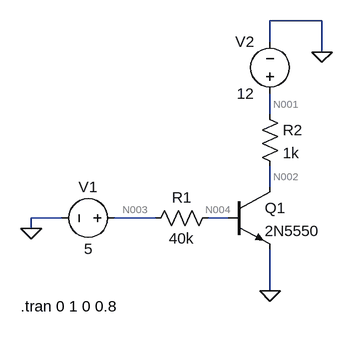
[diagram p0: schematic EJ5.asc]
EJ5.asc, the LTspice schematic file:
Version 4
SHEET 1 880 680
WIRE 432 -288 352 -288
WIRE 352 -256 352 -288
WIRE 432 -240 432 -288
WIRE 352 -144 352 -176
WIRE 352 -32 352 -64
WIRE 32 16 -16 16
WIRE 176 16 112 16
WIRE 288 16 256 16
WIRE -16 32 -16 16
WIRE 352 128 352 64
FLAG 352 128 0
FLAG -16 32 0
FLAG 432 -240 0
SYMBOL npn 288 -32 R0
SYMATTR InstName Q1
SYMATTR Value 2N5550
SYMBOL res 336 -160 R0
SYMATTR InstName R2
SYMATTR Value 1k
SYMBOL res 160 32 R270
WINDOW 0 32 56 VTop 2
WINDOW 3 0 56 VBottom 2
SYMATTR InstName R1
SYMATTR Value 40k
SYMBOL voltage 128 16 R90
WINDOW 0 -32 56 VBottom 2
WINDOW 3 32 56 VTop 2
WINDOW 123 0 0 Left 0
WINDOW 39 0 0 Left 0
SYMATTR InstName V1
SYMATTR Value 5
SYMBOL voltage 352 -160 R180
WINDOW 0 24 96 Left 2
WINDOW 3 24 16 Left 2
WINDOW 123 0 0 Left 0
WINDOW 39 0 0 Left 0
SYMATTR InstName V2
SYMATTR Value 12
TEXT -32 152 Left 2 !.tran 0 1 0 0.8

The netlist it stands for:
* EJ5.asc
Q1 N002 N004 0 0 2N5550
R2 N001 N002 1k
R1 N003 N004 40k
V1 N003 0 5
V2 N001 0 12
.model NPN NPN
.model PNP PNP
.lib standard.bjt
.tran 0 1 0 0.8
.backanno
.end

* Results of the author's LTspice run, read from the files saved beside the schematic
* Operating Point, zero values left out:
*   V(n002) = 178.5 mV
*   V(n004) = 756.9 mV
*   V(n001) = 12 V
*   V(n003) = 5 V
*   Ic(Q1) = 11.82 mA
*   Ib(Q1) = 106.1 µA
*   Ie(Q1) = -11.93 mA
*   I(R2) = 11.82 mA
*   I(R1) = 106.1 µA
*   I(V1) = -106.1 µA
*   I(V2) = -11.82 mA
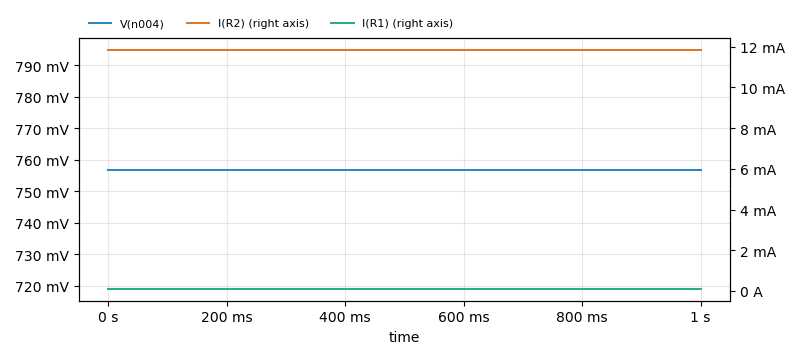
[diagram p1: Transient Analysis of EJ5.asc, plotted from the saved traces]
* Transient Analysis, 1 run:
*   V(n004): min 756.9 mV, max 756.9 mV, average 756.9 mV, rms 756.9 mV, last 756.9 mV
*   I(R2): min 11.82 mA, max 11.82 mA, average 11.82 mA, rms 11.82 mA, last 11.82 mA
*   I(R1): min 106.1 µA, max 106.1 µA, average 106.1 µA, rms 106.1 µA, last 106.1 µA